# Altium schematic sheet INT_REG.SchDoc
size B; SheetNumber: 4; SheetTotal: 8
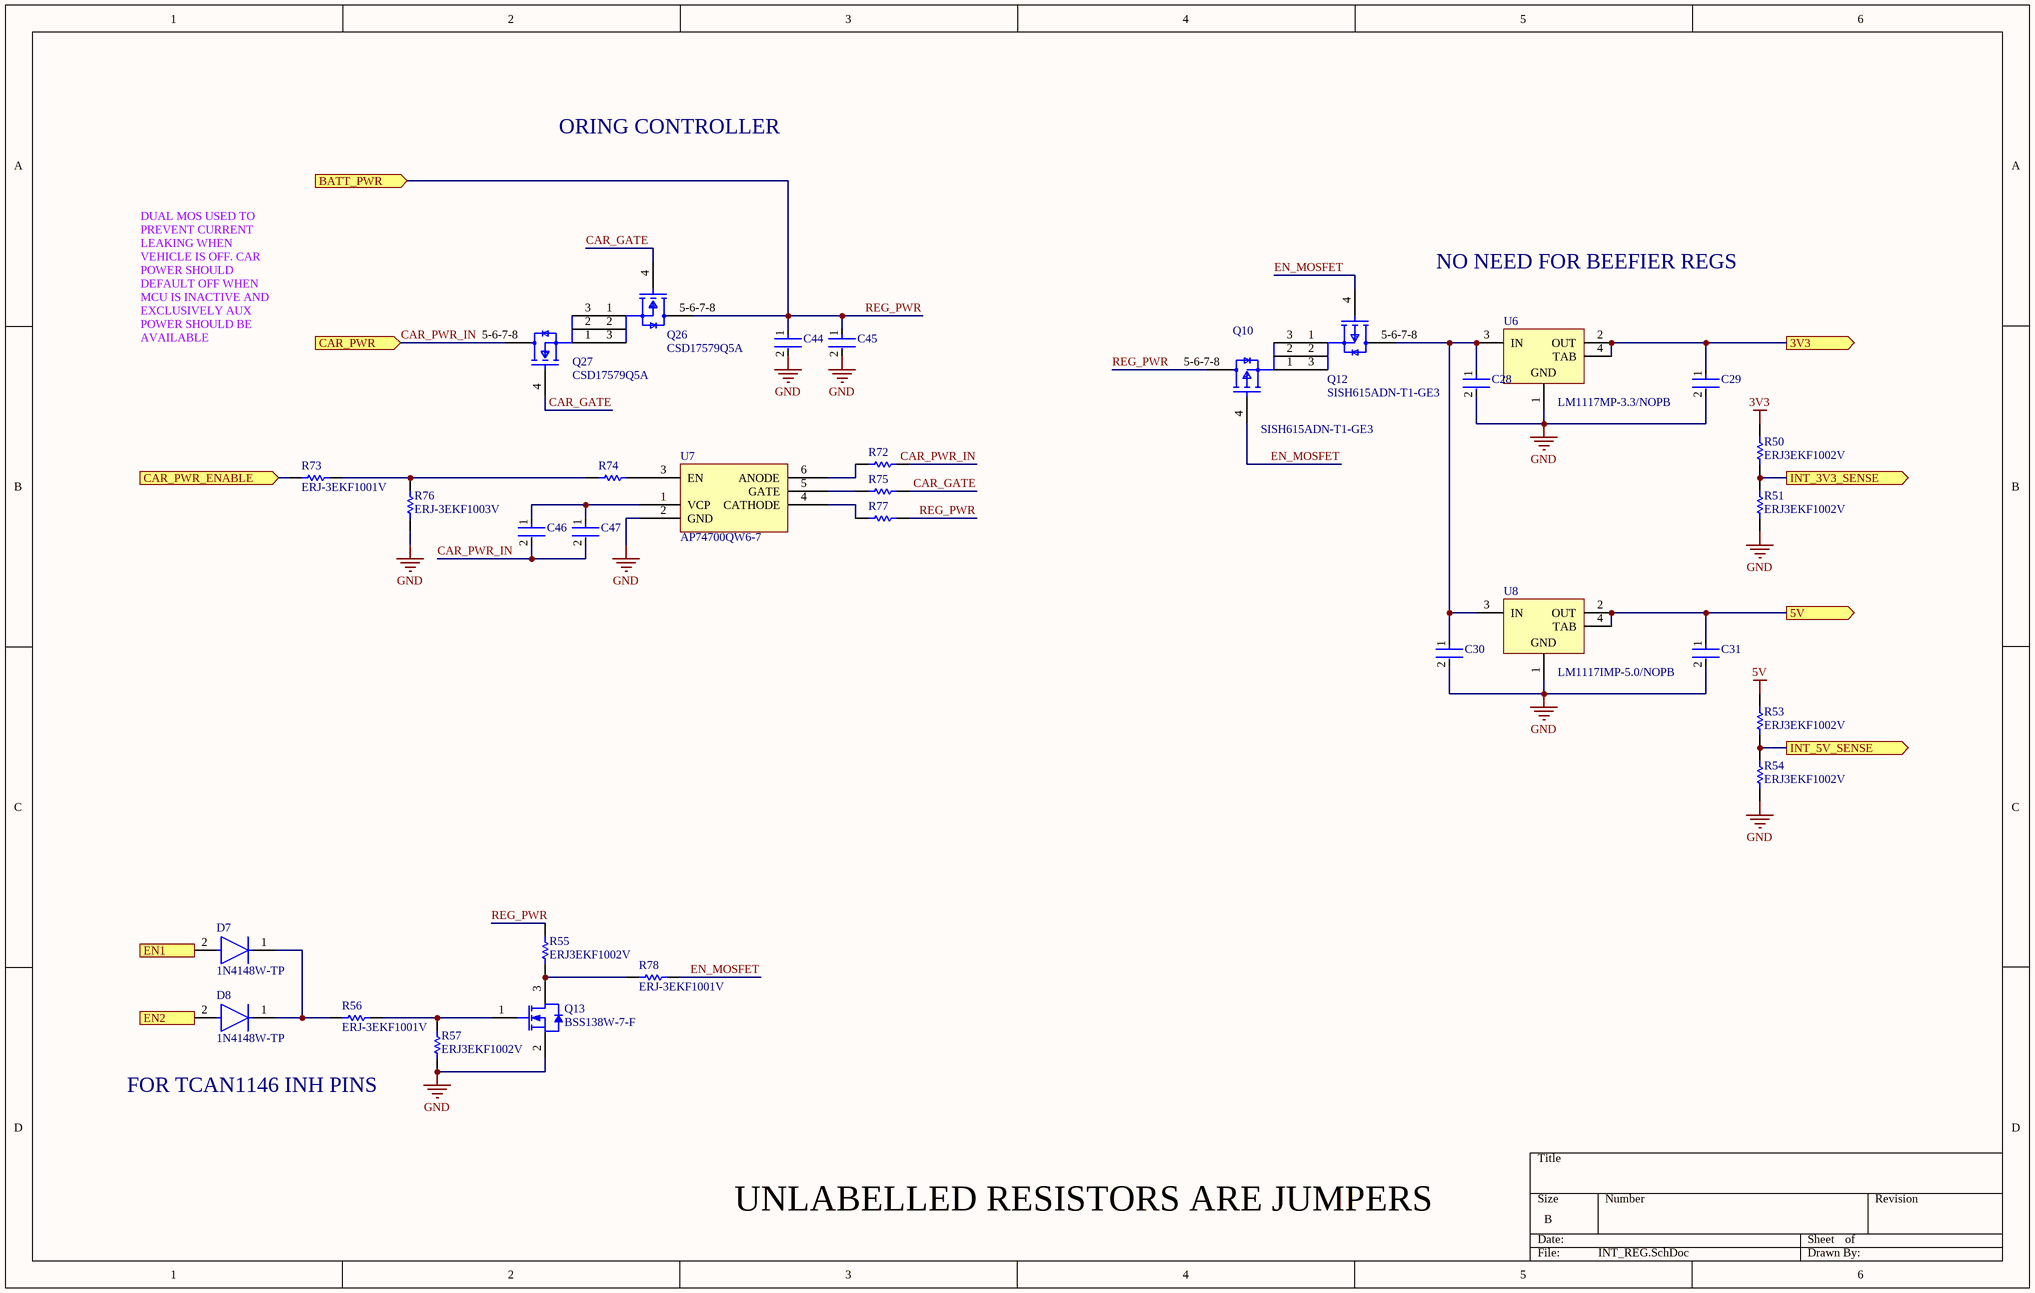
[diagram p0: INT_REG.SchDoc]

## Parts
C28  GRM188R61E106KA73D  [FP-GRM188-0_2-IPC_A]  (value not drawn)
C29  GRM188R61E106KA73D  [FP-GRM188-0_2-IPC_A]  (value not drawn)
C30  GRM188R61E106KA73D  [FP-GRM188-0_2-IPC_A]  (value not drawn)
C31  GRM188R61E106KA73D  [FP-GRM188-0_2-IPC_A]  (value not drawn)
C44  DNO (0805 CAP)  [FP-C0805C-DN-MFG]  (value not drawn)
C45  DNO (0805 CAP)  [FP-C0805C-DN-MFG]  (value not drawn)
C46  100n 25v  [FP-0402-L_1_0_0_05-W_0_5-IPC_A]  (value not drawn)
C47  100n 25v  [FP-0402-L_1_0_0_05-W_0_5-IPC_A]  (value not drawn)
D7  1N4148W-TP  [FP-SOD-123-IPC_A]
D8  1N4148W-TP  [FP-SOD-123-IPC_A]
Q10  SISH615ADN-T1-GE3  [SISH615ADN-T1-GE3-Footprint-1]
Q12  SISH615ADN-T1-GE3  [SISH615ADN-T1-GE3-Footprint-1]
Q13  BSS138W-7-F  [DIOD-SOT323-3_V]
Q26  CSD17579Q5A  [FP-DQJ0008A-MFG]
Q27  CSD17579Q5A  [FP-DQJ0008A-MFG]
R50  ERJ3EKF1002V  [RESC1609X55X30LL15T15]
R51  ERJ3EKF1002V  [RESC1609X55X30LL15T15]
R53  ERJ3EKF1002V  [RESC1609X55X30LL15T15]
R54  ERJ3EKF1002V  [RESC1609X55X30LL15T15]
R55  ERJ3EKF1002V  [RESC1609X55X30LL15T15]
R56  ERJ-3EKF1001V  [RESC1608X55X30LL15T15]
R57  ERJ3EKF1002V  [RESC1609X55X30LL15T15]
R72  RC0402JR-070RL  [RESC1005X40X25NL05T10]  (value not drawn)
R73  ERJ-3EKF1001V  [RESC1608X55X30LL15T15]
R74  RC0402JR-070RL  [RESC1005X40X25NL05T10]  (value not drawn)
R75  RC0402JR-070RL  [RESC1005X40X25NL05T10]  (value not drawn)
R76  ERJ-3EKF1003V  [RESC1608X55X30ML15T15]
R77  RC0402JR-070RL  [RESC1005X40X25NL05T10]  (value not drawn)
R78  ERJ-3EKF1001V  [RESC1608X55X30LL15T15]
U6  LM1117MP-3.3/NOPB  [DCY0004A_L]
U7  AP74700QW6-7  [SOT95P285X140-6N]
U8  LM1117IMP-5.0/NOPB  [DCY0004A_M]

## Ports
3V3 (out, see BRZ_BATT_MGR[3A]), 5V (out, see BRZ_BATT_MGR[3A]), BATT_PWR (in, see BRZ_BATT_MGR[2A]), CAR_PWR (in, see BRZ_BATT_MGR[2A]), CAR_PWR_ENABLE (in), EN1 (in, see BRZ_BATT_MGR[2A]), EN2 (in, see BRZ_BATT_MGR[2A]), INT_3V3_SENSE (out, see BRZ_BATT_MGR[3A], STM32H730_PINOUT[7A]), INT_5V_SENSE (out, see BRZ_BATT_MGR[3A], STM32H730_PINOUT[7A])

## Nets
3V3: R50.2
5V: R53.2
GND: C28.2 C29.2 C30.2 C31.2 C44.2 C45.2 Q13.2(S) R51.1 R54.2 R57.1 R76.1 U6.1(GND) U7.2(GND) U8.1(GND)
3V3: C29.1 U6.2(OUT) U6.4(TAB) ; port 3V3  [a separate net that carries the same name]
5V: C31.1 U8.2(OUT) U8.4(TAB) ; port 5V  [a separate net that carries the same name]
CAR_GATE: Q26.4(G) Q27.4(G) R75.2
CAR_PWR_ENABLE: R73.2 ; port CAR_PWR_ENABLE
CAR_PWR_IN: C46.2 C47.2 Q27.5-6-7-8(D) R72.2 ; port CAR_PWR
EN1: D7.2(A) ; port EN1
EN2: D8.2(A) ; port EN2
EN_MOSFET: Q10.4(G) Q12.4(G) R78.1
INT_3V3_SENSE: R50.1 R51.2 ; port INT_3V3_SENSE
INT_5V_SENSE: R53.1 R54.1 ; port INT_5V_SENSE
REG_PWR: C44.1 C45.1 Q10.5-6-7-8(D) Q26.5-6-7-8(D) R55.2 R77.2 ; port BATT_PWR
NetC28_1: C28.1 C30.1 Q12.5-6-7-8(D) U6.3(IN) U8.3(IN)
NetC46_1: C46.1 C47.1 U7.1(VCP)
NetD7_1: D7.1(C) D8.1(C) R56.2
NetQ10_1: Q10.1(S) Q12.3(S)
NetQ10_2: Q10.2(S) Q12.2(S)
NetQ10_3: Q10.3(S) Q12.1(S)
NetQ13_1: Q13.1(G) R56.1 R57.2
NetQ13_3: Q13.3(D) R55.1 R78.2
NetQ26_1: Q26.1(S) Q27.3(S)
NetQ26_2: Q26.2(S) Q27.2(S)
NetQ26_3: Q26.3(S) Q27.1(S)
NetR72_1: R72.1 U7.6(ANODE)
NetR73_1: R73.1 R74.1 R76.2
NetR74_2: R74.2 U7.3(EN)
NetR75_1: R75.1 U7.5(GATE)
NetR77_1: R77.1 U7.4(CATHODE)

## Notes on the sheet
- ORING CONTROLLER
- NO NEED FOR BEEFIER REGS
- DUAL MOS USED TO PREVENT CURRENT LEAKING WHEN VEHICLE IS OFF. CAR POWER SHOULD DEFAULT OFF WHEN MCU IS INACTIVE AND EXCLUSIVELY AUX POWER SHOULD BE AVAILABLE
- FOR TCAN1146 INH PINS
- UNLABELLED RESISTORS ARE JUMPERS

## Library data of the parts
C28-C31 = CMP-06035-045268-1: Chip Multilayer Ceramic Capacitors for General Purpose, 0603, 10uF, X5R, 15%, 10%, 25V; Case/Package: 0603
C44 C45 = CMP-1036-04552-2: CAP CER 0.22UF 50V X7R 0805; Manufacturer: KEMET; Manufacturer Part Number: C0805C224K5RACTU; Value: 0.22 μF; Temperature Coefficient: 30ppm/°C; Material: Ceramic; Tolerance: 0.1; ComponentLink2URL: https://content.kemet.com/datasheets/KEM_C1003_C0G_SMD.pdf; Temperature Characteristic: X7R; Device Class L3: Ceramic Capacitors; Lead Free: Yes; Temperature: -55°C to +125°C; RoHS: TRUE; Capacitance: 0.22 μF; Automotive: No; Octopart: https://octopart.com/c0805c224k5ractu-kemet-144670; Temperature Range Low: -55°C; Height: 0.88mm; Device Class L1: Passive Components; Digikey Description: CAP CER 0.22UF 50V X7R 0805; ComponentLink2Description: Datasheet; Mouser Description: CAP CER 0.22UF 50V X7R 0805; Category: Cap; Ipc Land Pattern Name: CAPC200125X78; Temperature Range High: +125°C; Package: C0805C-DN; Device Class L2: Capacitors; Voltage Rating: 50 V
C46 C47 = CMP-001-00058-1: LARGE PADS, 0402 CAP, CHANGE COMMENT TO MATCH REAL P/N; Capacitor Type: Ceramic; Min Operating Temperature: -55°C; Mounting Technology: Surface Mount; Pins: 2; Case/Package: 0402; RoHS Compliant: Yes; Max Operating Temperature: 85°C
D7 D8 = CMP-2000-04993-2: DIODE GEN PURP 100V 150MA SOD123; Max Reverse Leakage Current: 5uA; Max Surge Current: 2A; Reverse Recovery Time: 4ns; Polarity: Standard; Capacitance: 4pF; Max Forward Surge Current (Ifsm): 1A; Element Configuration: Single; Power Dissipation: 400mW; Forward Voltage: 1V; Radiation Hardening: No; Lead Free: Lead Free; Max Reverse Voltage (DC): 100V; Current Rating: 150mA; Forward Current: 150mA; Packaging: Tape and Reel; Number of Pins: 2; Package Quantity: 3000; Max Operating Temperature: 150°C; Min Operating Temperature: -65°C; Average Rectified Current: 150mA; Recovery Time: 4ns; Output Current: 150mA; Peak Non-Repetitive Surge Current: 2A; Width: 1.8mm; Voltage Rating (DC): 100V; Height: 1.2mm; Max Repetitive Reverse Voltage (Vrrm): 100V; Mount: Surface Mount; Length: 2.85mm
Q10 Q12 = CMP-013-00036-1: Trans MOSFET P-CH 20V 22.1A 8-Pin PowerPAK 1212 EP T/R
Q13 = CMP-2000-05968-1: N-Channel Enhancement Mode Mosfet, 50 V, 200 mA, -55 to 150 degC, 6-Pin SOT-323, RoHS, Tape and Reel; Typical Turn-Off Delay Time: 20ns; Number of Channels: 1Channel; Type: EnhancementModeFieldEffectTransistor; Brand: DiodesIncorporated; Vds - Drain-Source Breakdown Voltage: 75V; Vgs - Gate-Source Voltage: 20V; Rds On - Drain-Source Resistance: 1.4Ohms; Transistor Type: 1N-Channel; Configuration: Single; Unit Weight: 0.000212oz; Pd - Power Dissipation: 200mW; Id - Continuous Drain Current: 200mA; Forward Transconductance - Min: 0.1S; Manufacturer URL: http://www.diodes.com/; Series: BSS138; Package Description: 3-Pin Small Outline Transistor, Body 2 x 1.25 mm, Pitch 0.65 mm; Mounting Technology: SurfaceMount; Product Category: MOSFET; RoHS: True; Maximum Operating Temperature: +150C; Height: 1mm; Length: 2.2mm; Technology: Si; Width: 1.35mm; Datasheet URL: http://www.diodes.com/_files/datasheets/ds30206.pdf; Manufacturer: DiodesIncorporated; Package / Case: SOT-323-3; Typical Turn-On Delay Time: 20ns; Transistor Polarity: N-Channel; Factory Pack Quantity: 3000; Packaging: Reel; Product: MOSFETSmallSignal; Datasheet Version: Rev. 11-2, 09/2013; Package Reference: SOT323; Minimum Operating Temperature: -55C; Mounting Style: SMD/SMT; Channel Mode: Enhancement
Q26 Q27 = CMP-04962-000063-1: MOSFET N-CH 30V 25A 8VSON; Rise Time: 7ns; Element Configuration: Single; Max Power Dissipation: 3.1W; Input Capacitance: 1.03nF; Turn-Off Delay Time: 13ns; Fall Time: 1ns; Turn-On Delay Time: 3ns; Gate to Source Voltage (Vgs): 20V; Rds On Max: 9.7mR; Mount: Surface Mount; Contact Plating: Tin; Lead Free: Contains Lead; Max Operating Temperature: 150°C; Packaging: Tape and Reel; Min Operating Temperature: -55°C; Number of Pins: 8; Drain to Source Voltage (Vdss): 30V; RoHS Compliant: Yes; Continuous Drain Current (ID): 25A
R50 R51 R53-R55 R57 = CMP-1012-00623-3: Chip Resistor, 10 KOhm, +/- 1%, 0.1 W, -55 to 155 degC, 0603 (1608 Metric), RoHS, Tape and Reel; Manufacturer: Panasonic; Voltage Rating: 75V; Case\/Package: 0603; Power Rating: 100mW; Resistance: 10KOhm; Temperature Coefficient: 100ppm\/degreesC; Number of Pins: 2; Package Reference: 603; Depth: 0.8mm; Mount: SurfaceMount; Package Description: 2-Pin Surface Mount Device, Body 1.6 x 0.85 mm; Datasheet Version: 02/2017; Length: 1.6mm; Lead Free: LeadFree; Height: 0.45mm; Number of Terminations: 2; Max Power Dissipation: 100mW; Min Operating Temperature: -55degC; Datasheet URL: https://industrial.panasonic.com/cdbs/www-data/pdf/RDA0000/AOA0000C304.pdf; Termination: SMD/SMT; Case Code (Metric): 1608; Case Code (Imperial): 0603; Tolerance: 1%; Max Operating Temperature: 155degC; RoHSCompliant: true; Voltage Rating (DC): 75V; Radiation Hardening: No; Packaging: TapeandReel; Composition: ThickFilm; Mounting Technology: SurfaceMount; Manufacturer URL: http://www.panasonic.com/; Width: 0.031inch; REACH SVHC: NoSVHC; Contact Plating: Tin; Military Standard: Not; Package Quantity: 1
R56 R73 R78 = CMP-2000-00180-1: Manufacturer: Panasonic; Part Number: ERJ-3EKF1001V
R72 R74 R75 R77 = CMP-1011-00001-2: Manufacturer: Yageo / Phycomp; Part Number: RC0402JR-070RL
R76 = CMP-2000-00182-1: Manufacturer: Panasonic; Part Number: ERJ-3EKF1003V
U6 = CMP-0062-01638-4: 800mA Low-Dropout Linear Regulator, 4-pin SOT-223, Pb-Free; Manufacturer: Texas Instruments; CompType: LDO IC; PackageTopMarking: XYTT*N05A; High-Reliability: Y; PowerWise: N; ComponentLink1URL: http://www.ti.com/general/docs/lit/getliterature.tsp?genericPartNumber=LM1117-N&fileType=pdf; PinCount: 4; PackageDescription: Molded SOT-223, 6.50 x 3.56 x 1.6mm Body, 4 Lead, 2.3mm Pitch; Code_IPC: SOT223-4; PartNumber: LM1117MP-3.3/NOPB; Code_JEDEC: TO-261-AA; RoHS: Y; PackageReference: DCY0004A; ComponentLink1Description: Datasheet URL
U7 = CMP-019-00037-1: SOT 26/Aï¿½/ +/- 65 V Reverse Voltage Protected Ideal Diode Controller
U8 = CMP-0062-01627-4: 800mA Low-Dropout Linear Regulator, 4-pin SOT-223, Pb-Free; Manufacturer: Texas Instruments; PackageTopMarking: XYTT*N06B; CompType: LDO IC; PowerWise: N; High-Reliability: Y; RoHS: Y; Code_JEDEC: TO-261-AA; ComponentLink1URL: http://www.ti.com/general/docs/lit/getliterature.tsp?genericPartNumber=LM1117-N&fileType=pdf; Code_IPC: SOT223-4; ComponentLink1Description: Datasheet URL; PartNumber: LM1117IMP-5.0/NOPB; PackageReference: DCY0004A; PinCount: 4; PackageDescription: Molded SOT-223, 6.50 x 3.56 x 1.6mm Body, 4 Lead, 2.3mm Pitch